# Altium schematic sheet Radio_module.SchDoc
size A4; SheetNumber: 12; SheetTotal: 18
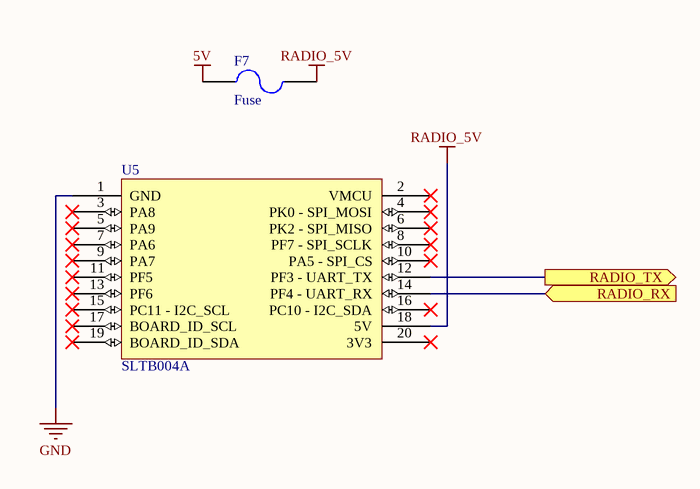
[diagram p0: Radio_module.SchDoc]

## Parts
F7  Fuse  [F_0603]
U5  SLTB004A  [SLTB004A]

## Ports
RADIO_RX (in), RADIO_TX (out)

## Nets
5V: F7.1
GND: U5.1(GND)
RADIO_5V: F7.2 U5.18(5V)
RADIO_RX: U5.14(PF4_-_UART_RX) ; port RADIO_RX
RADIO_TX: U5.12(PF3_-_UART_TX) ; port RADIO_TX

Not connected (* = marked no-connect by the designer): U5 2(VMCU)* 3(PA8)* 4(PK0_-_SPI_MOSI)* 5(PA9)* 6(PK2_-_SPI_MISO)* 7(PA6)* 8(PF7_-_SPI_SCLK)* 9(PA7)* 10(PA5_-_SPI_CS)* 11(PF5)* 13(PF6)* 15(PC11_-_I2C_SCL)* 16(PC10_-_I2C_SDA)* 17(BOARD_ID_SCL)* 19(BOARD_ID_SDA)* 20(3V3)*

## Library data of the parts
F7 = Oth_MC06CF.500_F_0603: NI part number: 766324-01; Order number: 1841006; Rating: 32VDC; Type: Very Fast Acting Fuse; Value: 500mA; NI PEN/DEB: DEB; Distributor: Farnell; ID: Oth_MC06CF.500_F_0603; Link: http://hu.farnell.com/multicomp/mc06cf-500/fuse-smd-0603-0-5a/dp/1841006; Package: F_0603; Part Number: MC06CF.500; Price (HUF): 125
U5 = SLTB004A: SiLabs Thunderboard Sense 2 module